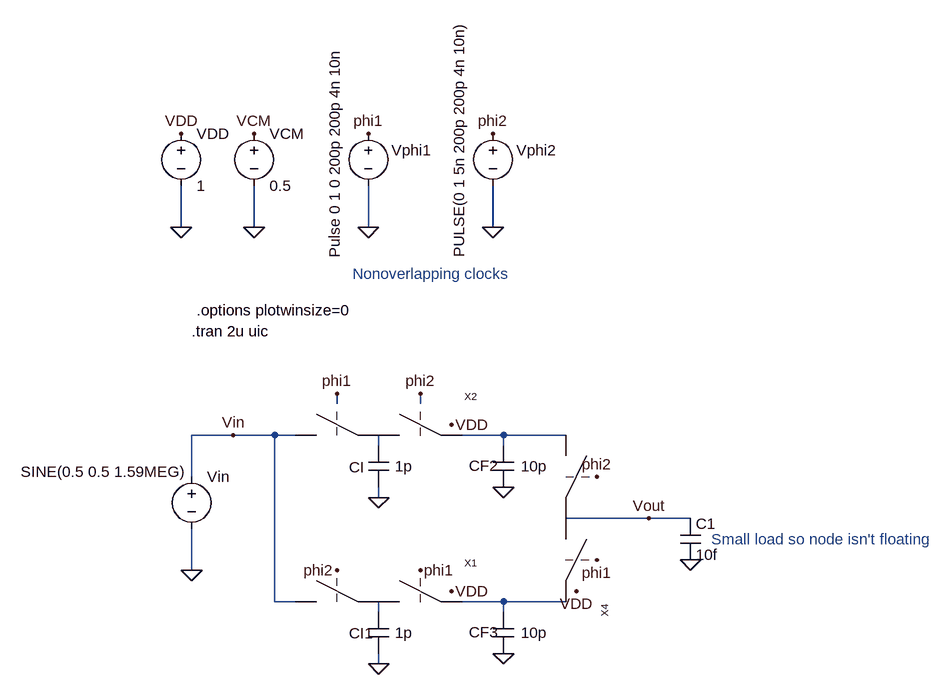
[diagram p0: schematic _Fig2_36_MSD.asc]
_Fig2_36_MSD.asc, the LTspice schematic file:
Version 4
SHEET 1 2740 696
WIRE 592 -704 592 -768
WIRE 704 -704 704 -768
WIRE 880 -704 880 -768
WIRE 1072 -704 1072 -768
WIRE 832 -432 832 -448
WIRE 960 -432 960 -448
WIRE 672 -384 608 -384
WIRE 736 -384 672 -384
WIRE 768 -384 736 -384
WIRE 1088 -384 1024 -384
WIRE 1184 -384 1088 -384
WIRE 896 -368 896 -384
WIRE 1088 -368 1088 -384
WIRE 608 -320 608 -384
WIRE 896 -288 896 -304
WIRE 1312 -256 1184 -256
WIRE 1376 -256 1312 -256
WIRE 608 -176 608 -240
WIRE 736 -128 736 -384
WIRE 768 -128 736 -128
WIRE 1088 -128 1024 -128
WIRE 1184 -128 1088 -128
WIRE 896 -112 896 -128
WIRE 1088 -112 1088 -128
WIRE 896 -32 896 -48
FLAG 608 -176 0
FLAG 672 -384 Vin
FLAG 880 -704 0
FLAG 880 -848 phi1
FLAG 592 -704 0
FLAG 592 -848 VDD
FLAG 1008 -400 VDD
FLAG 832 -448 phi1
FLAG 960 -448 phi2
FLAG 1072 -704 0
FLAG 1072 -848 phi2
FLAG 704 -704 0
FLAG 704 -848 VCM
FLAG 896 -288 0
FLAG 1008 -144 VDD
FLAG 832 -176 phi2
FLAG 960 -176 phi1
FLAG 896 -32 0
FLAG 1088 -304 0
FLAG 1088 -48 0
FLAG 1200 -144 VDD
FLAG 1232 -320 phi2
FLAG 1232 -192 phi1
FLAG 1312 -256 Vout
FLAG 1376 -192 0
SYMBOL voltage 608 -336 R0
WINDOW 123 0 0 Left 0
WINDOW 39 0 0 Left 0
WINDOW 3 -263 8 Left 0
SYMATTR Value SINE(0.5 0.5 1.59MEG)
SYMATTR InstName Vin
SYMBOL voltage 880 -864 R0
WINDOW 0 36 42 Left 0
WINDOW 3 -52 207 VLeft 0
WINDOW 123 0 0 Left 0
WINDOW 39 0 0 Left 0
SYMATTR InstName Vphi1
SYMATTR Value Pulse 0 1 0 200p 200p 4n 10n
SYMBOL voltage 592 -864 R0
WINDOW 123 0 0 Left 0
WINDOW 39 0 0 Left 0
SYMATTR InstName VDD
SYMATTR Value 1
SYMBOL switches_2 768 -368 R0
SYMATTR InstName X2
SYMBOL cap 880 -368 R0
WINDOW 0 -30 33 Left 0
WINDOW 3 41 32 Left 0
SYMATTR InstName CI
SYMATTR Value 1p
SYMBOL voltage 1072 -864 R0
WINDOW 0 36 42 Left 0
WINDOW 3 -52 207 VLeft 0
WINDOW 123 0 0 Left 0
WINDOW 39 0 0 Left 0
SYMATTR InstName Vphi2
SYMATTR Value PULSE(0 1 5n 200p 200p 4n 10n)
SYMBOL voltage 704 -864 R0
WINDOW 123 0 0 Left 0
WINDOW 39 0 0 Left 0
SYMATTR InstName VCM
SYMATTR Value 0.5
SYMBOL switches_2 768 -112 R0
SYMATTR InstName X1
SYMBOL cap 880 -112 R0
WINDOW 0 -30 33 Left 0
WINDOW 3 41 32 Left 0
SYMATTR InstName CI1
SYMATTR Value 1p
SYMBOL cap 1072 -368 R0
WINDOW 0 -37 31 Left 0
WINDOW 3 43 32 Left 0
SYMATTR InstName CF2
SYMATTR Value 10p
SYMBOL cap 1072 -112 R0
WINDOW 0 -37 31 Left 0
WINDOW 3 43 32 Left 0
SYMATTR InstName CF3
SYMATTR Value 10p
SYMBOL switches_2 1168 -384 R90
SYMATTR InstName X4
SYMBOL cap 1360 -256 R0
SYMATTR InstName C1
SYMATTR Value 10f
TEXT 608 -544 Left 0 !.tran 2u uic
TEXT 856 -632 Left 0 ;Nonoverlapping clocks
TEXT 616 -576 Left 0 !.options plotwinsize=0
TEXT 1408 -224 Left 0 ;Small load so node isn't floating

The netlist it stands for:
* _Fig2_36_MSD.asc
Vin Vin 0 SINE(0.5 0.5 1.59MEG)
Vphi1 phi1 0 Pulse 0 1 0 200p 200p 4n 10n
VDD VDD 0 1
XX2 Vin phi1 phi2 N001 VDD N002 switches_2  ; pins P1 clk1 Clk2 P3 VDD P2
CI N002 0 1p
Vphi2 phi2 0 PULSE(0 1 5n 200p 200p 4n 10n)
VCM VCM 0 0.5
XX1 Vin phi2 phi1 N003 VDD N004 switches_2  ; pins P1 clk1 Clk2 P3 VDD P2
CI1 N004 0 1p
CF2 N001 0 10p
CF3 N003 0 10p
XX4 N001 phi2 phi1 N003 VDD Vout switches_2  ; pins P1 clk1 Clk2 P3 VDD P2
C1 Vout 0 10f
.tran 2u uic
* Nonoverlapping clocks
.options plotwinsize=0
* Small load so node isn't floating
.backanno
.end